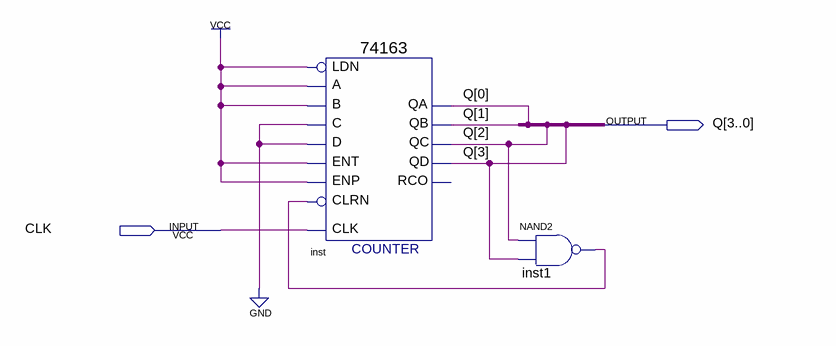
[diagram p0: schematic sheet]
// Quartus schematic modulo.bdf as structural Verilog: 2 symbols, 2 pins
module modulo (
  input  CLK,
  output [3:0] Q
);

  wire inst1_out;

  \74163  inst (
    .C(1'b0), .B(1'b1), .A(1'b1), .ENT(1'b1), .D(1'b0), .CLRN(inst1_out), .CLK(CLK), .ENP(1'b1), .LDN(1'b1),
    .QA(Q[0]), .QB(Q[1]), .QC(Q[2]), .QD(Q[3]));  // open: RCO
  nand inst1 (inst1_out, Q[2], Q[3]);
endmodule
